# EAGLE design MotorsAndLighthouseShield (EAGLE 9.1.0)

## Sheet 1 of 2
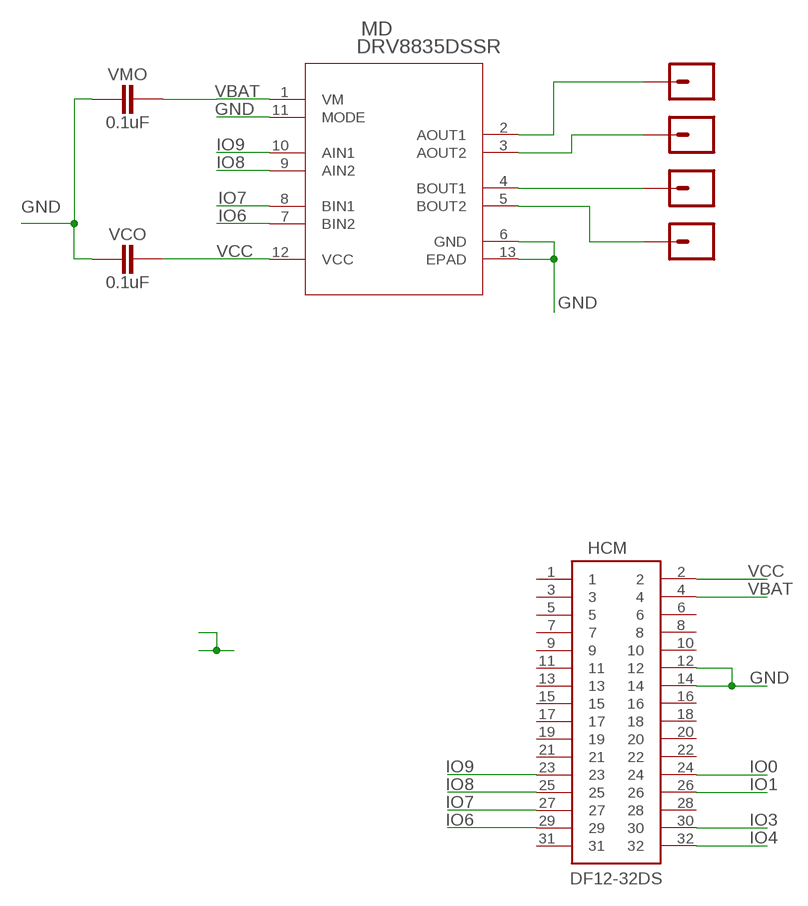
[diagram p0: schematic, sheet 1]

### Parts
AO1  SINGLE-THROUGH-HOLE  [SINGLE-THROUGH-HOLE]
AO2  SINGLE-THROUGH-HOLE  [SINGLE-THROUGH-HOLE]
B02  SINGLE-THROUGH-HOLE  [SINGLE-THROUGH-HOLE]
BO1  SINGLE-THROUGH-HOLE  [SINGLE-THROUGH-HOLE]
HCM  HIROSE-DF12-32DSMALE  [DF12(3.0)-32DS-0.5V(86)-MALE]
MD  DRV8835DSSR  [DSS12_P9X2]
VCO  0.1uF  CAPACITOR  [PASSIVE-0603]
VMO  0.1uF  CAPACITOR  [PASSIVE-0603]

### Nets
GND: HCM.12 HCM.14 MD.6(GND) MD.11(MODE) MD.13(EPAD) VCO.1 VMO.1 ; also sheet 2
IO0: HCM.24 ; also sheet 2
IO1: HCM.26 ; also sheet 2
IO3: HCM.30
IO4: HCM.32
IO6: HCM.29 MD.7(BIN2)
IO7: HCM.27 MD.8(BIN1)
IO8: HCM.25 MD.9(AIN2)
IO9: HCM.23 MD.10(AIN1)
N$1: BO1.1 MD.2(AOUT1)
N$2: B02.1 MD.3(AOUT2)
N$3: AO1.1 MD.4(BOUT1)
N$4: AO2.1 MD.5(BOUT2)
VBAT: HCM.4 MD.1(VM) VMO.2
VCC: HCM.2 MD.12(VCC) VCO.2 ; also sheet 2
Unconnected: HCM.1 HCM.3 HCM.5 HCM.6 HCM.7 HCM.8 HCM.9 HCM.10 HCM.11 HCM.13 HCM.15 HCM.16 HCM.17 HCM.18 HCM.19 HCM.20 HCM.21 HCM.22 HCM.28 HCM.31

## Sheet 2 of 2
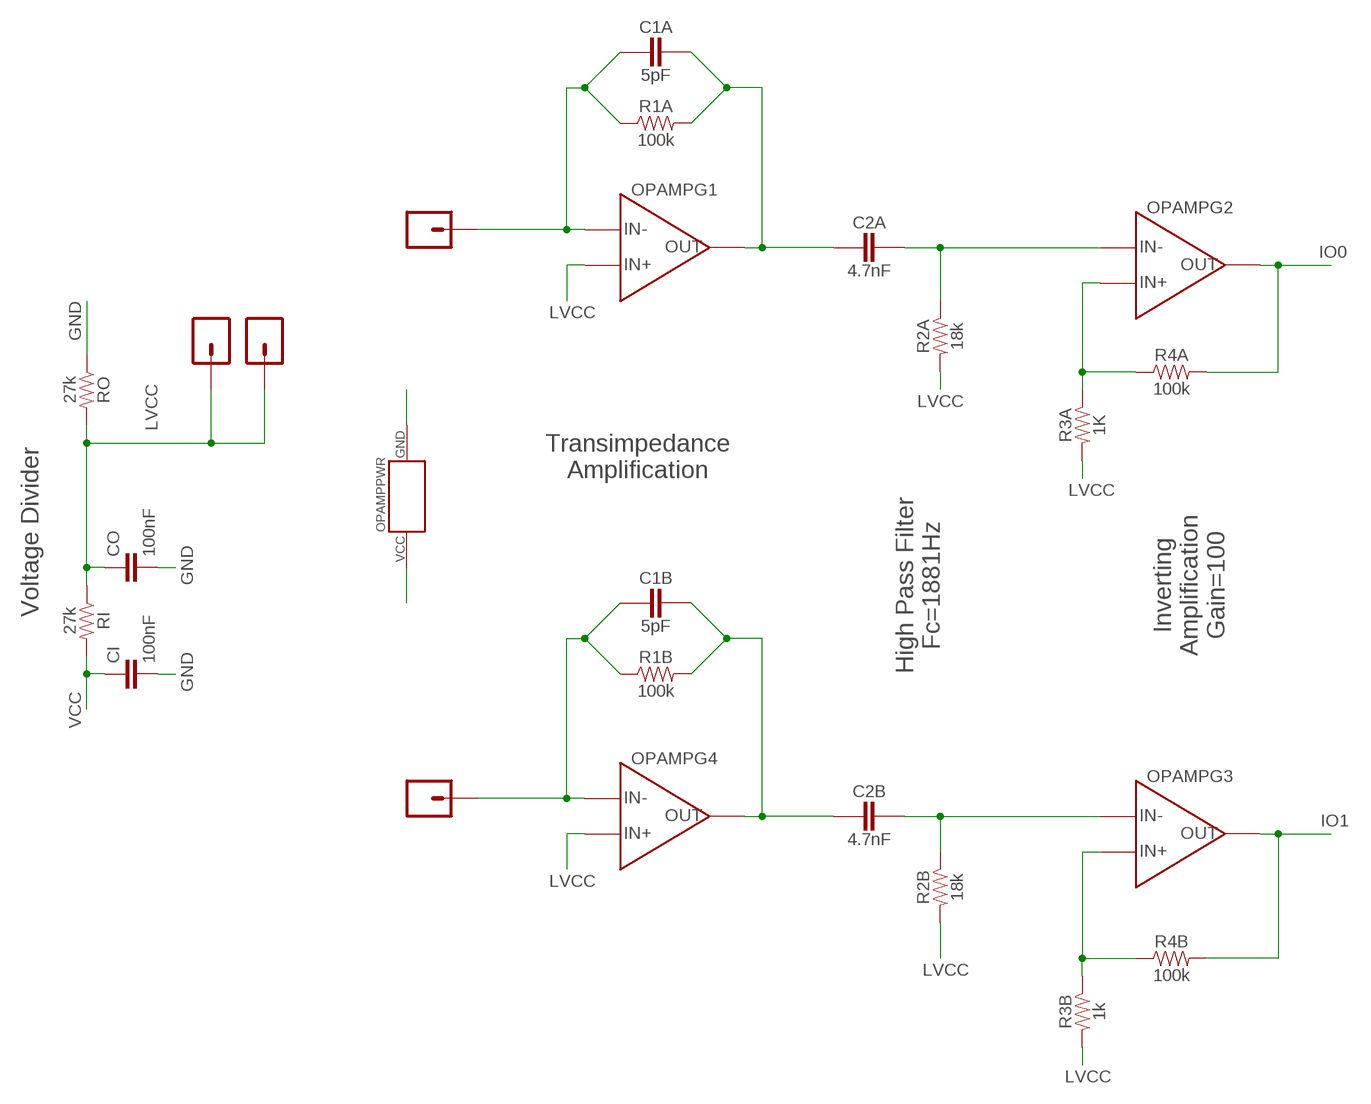
[diagram p1: schematic, sheet 2]

### Parts
C1A  5pF  CAPACITOR  [PASSIVE-0603]
C1B  5pF  CAPACITOR  [PASSIVE-0603]
C2A  4.7nF  CAPACITOR  [PASSIVE-0603]
C2B  4.7nF  CAPACITOR  [PASSIVE-0603]
CI  100nF  4.7PF-0603-50V-5%  [0603]
CO  100nF  4.7PF-0603-50V-5%  [0603]
DIA  SINGLE-THROUGH-HOLE  [SINGLE-THROUGH-HOLE]
DIB  SINGLE-THROUGH-HOLE  [SINGLE-THROUGH-HOLE]
DOA  SINGLE-THROUGH-HOLE  [SINGLE-THROUGH-HOLE]
DOB  SINGLE-THROUGH-HOLE  [SINGLE-THROUGH-HOLE]
OPAMP  TLV2464IPW  [PW14]
R1A  100k  RESISTOR  [PASSIVE-0603]
R1B  100k  RESISTOR  [PASSIVE-0603]
R2A  18k  RESISTOR  [PASSIVE-0603]
R2B  18k  RESISTOR  [PASSIVE-0603]
R3A  1K  RESISTOR  [PASSIVE-0603]
R3B  1k  RESISTOR  [PASSIVE-0603]
R4A  100k  RESISTOR  [PASSIVE-0603]
R4B  100k  RESISTOR  [PASSIVE-0603]
RI  27k  100KOHM-0603-1/10W-1%  [0603]
RO  27k  100KOHM-0603-1/10W-1%  [0603]

### Nets
D1IN1: C1B.1 DIB.1 OPAMP.13(IN-) R1B.1
D1OA2P1: C2B.2 OPAMP.9(IN-) R2B.1
D1OAOUT2: C1B.2 C2B.1 OPAMP.14(OUT) R1B.2
D2IN1: C1A.1 DIA.1 OPAMP.2(IN-) R1A.1
D2OA1OUT1: C1A.2 C2A.1 OPAMP.1(OUT) R1A.2
D2OA2N1: OPAMP.5(IN+) R3A.1 R4A.1
D2OA2P1: C2A.2 OPAMP.6(IN-) R2A.1
GND: CI.2 CO.2 OPAMP.11(PWR:GND) RO.1 ; also sheet 1
IO0: OPAMP.7(OUT) R4A.2 ; also sheet 1
IO1: OPAMP.8(OUT) R4B.2 ; also sheet 1
LVCC: CO.1 DOA.1 DOB.1 OPAMP.3(IN+) OPAMP.12(IN+) R2A.2 R2B.2 R3A.2 R3B.2 RI.1 RO.2
N$11: OPAMP.10(IN+) R3B.1 R4B.1
VCC: CI.1 OPAMP.4(PWR:VCC) RI.2 ; also sheet 1

### Notes on the sheet
- Transimpedance
  Amplification
- Voltage Divider
- High Pass Filter
  Fc=1881Hz
- Inverting
  Amplification
  Gain=100

## Library data of the parts
AO1 AO2 B02 BO1 DIA DIB DOA DOB = ZippyComponentLibrary:SINGLE-THROUGH-HOLE
C1A C1B C2A C2B VCO VMO = ZippyComponentLibrary:CAPACITOR
CI CO = SparkFun-Capacitors:4.7PF: 4.7pF ceramic capacitors A capacitor is a passive two-terminal electrical component used to store electrical energy temporarily in an electric field.; PROD_ID: CAP-07880; VALUE: 4.7pF
HCM = ZippyComponentLibrary:HIROSE-DF12-32DS
MD = ZippyComponentLibrary:DRV8835DSSR; MANUFACTURER_PART_NUMBER: DRV8835DSSR; VENDOR: Texas Instruments
OPAMP = ZippyComponentLibrary:TLV2464
R1A R1B R2A R2B R3A R3B R4A R4B = ZippyComponentLibrary:RESISTOR
RI RO = SparkFun-Resistors:100KOHM: 100kΩ resistor A resistor is a passive two-terminal electrical component that implements electrical resistance as a circuit element. Resistors act to reduce current flow, and, at the same time, act to lower voltage levels within circuits. - Wikipedia; PROD_ID: RES-07828; VALUE: 100k

## Board
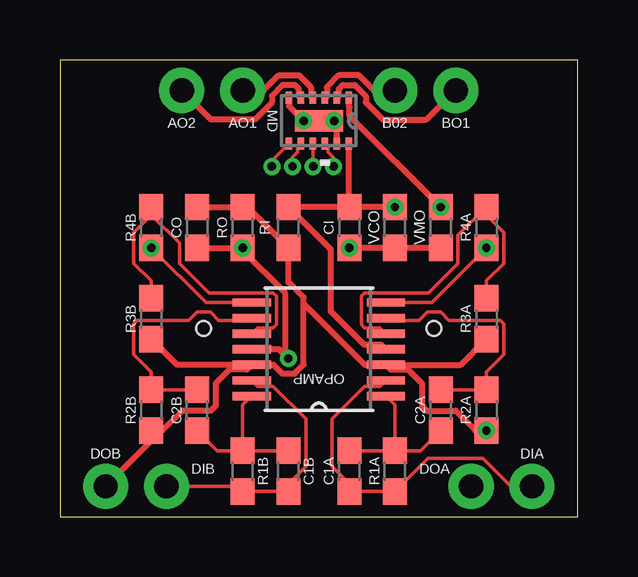
[diagram p2: board, top side]
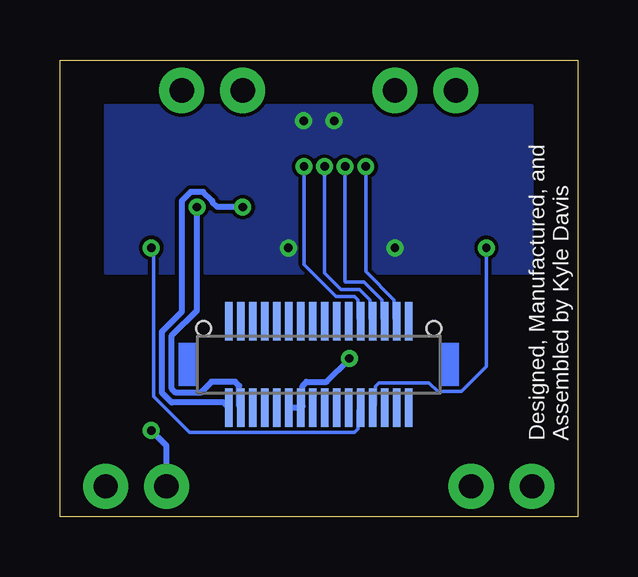
[diagram p3: board, bottom side, seen from below]

Size 21.59 x 19.05 mm. Coordinates in mm from the lower left corner, seen from the top.
Outline: 0,0 21.59,0 21.59,19.05 0,19.05 0,0
Copper layers (1*16): Top 0.0356mm / dielectric 1.5011mm / Bottom 0.0356mm
Design rules "LaenPCBOrder *": minimum track width 6mil, minimum drill 13mil, track to track 6mil, track to pad 6mil, pad to pad 6mil, via to via 6mil, smd to smd 6mil, copper to edge 12mil, drill to drill 6mil, minimum pad ring 7mil, minimum via ring 7mil, stop-mask expansion 3mil, vias tented up to drill 0mil, thermal gap 10mil

### Footprints (pad centres in the part's own frame; a part is rotated, then mirrored left to right if it is on the bottom)
SINGLE-THROUGH-HOLE = drill 1.016 pad 1.88: 1 0,0
PASSIVE-0603 = smd 1.1 x 1: 1 -0.85,0; 2 0.85,0
0603 = smd 1.1 x 1: 1 -0.85,0; 2 0.85,0
DF12(3.0)-32DS-0.5V(86)-MALE = smd 0.3 x 1.6: 1 3.75,-1.8; 2 3.75,1.8; 3 3.25,-1.8; 4 3.25,1.8; 5 2.75,-1.8; 6 2.75,1.8; 7 2.25,-1.8; 8 2.25,1.8; 9 1.75,-1.8; 10 1.75,1.8; 11 1.25,-1.8; 12 1.25,1.8; 13 0.75,-1.8; 14 0.75,1.8; 15 0.25,-1.8; 16 0.25,1.8; 17 -0.25,-1.8; 18 -0.25,1.8; 19 -0.75,-1.8; 20 -0.75,1.8; 21 -1.25,-1.8; 22 -1.25,1.8; 23 -1.75,-1.8; 24 -1.75,1.8; 25 -2.25,-1.8; 26 -2.25,1.8; 27 -2.75,-1.8; 28 -2.75,1.8; 29 -3.25,-1.8; 30 -3.25,1.8; 31 -3.75,-1.8; 32 -3.75,1.8 | hole 0.6: -4.8,-1.5; 4.8,-1.5
DSS12_P9X2 = smd 0.5 x 0.28: 1 -0.959,1.25; 2 -0.959,0.75; 3 -0.959,0.25; 4 -0.959,-0.25; 5 -0.959,-0.75; 6 -0.959,-1.25; 7 0.959,-1.25; 8 0.959,-0.75; 9 0.959,-0.25; 10 0.959,0.25; 11 0.959,0.75; 12 0.959,1.25 | smd 0.9 x 2: 13 0,0
PW14 = smd 1.6 x 0.35: 1 -2.8,1.95; 2 -2.8,1.3; 3 -2.8,0.65; 4 -2.8,0; 5 -2.8,-0.65; 6 -2.8,-1.3; 7 -2.8,-1.95; 8 2.8,-1.95; 9 2.8,-1.3; 10 2.8,-0.65; 11 2.8,0; 12 2.8,0.65; 13 2.8,1.3; 14 2.8,1.95

### Placement (x,y rotation side)
AO1  7.62,17.78 0 top
AO2  5.08,17.78 0 top
B02  13.97,17.78 0 top
BO1  16.51,17.78 0 top
C1A  12.06,1.91 90 top
C1B  9.53,1.91 90 top
C2A  15.88,4.45 90 top
C2B  5.71,4.45 90 top
CI  12.06,12.06 270 top
CO  5.71,12.06 270 top
DIA  19.68,1.27 180 top
DIB  4.45,1.27 180 top
DOA  17.14,1.27 180 top
DOB  1.91,1.27 180 top
HCM  10.79,6.35 180 bottom
MD  10.79,16.51 270 top
OPAMP  10.79,6.99 180 top
R1A  13.97,1.91 90 top
R1B  7.62,1.91 90 top
R2A  17.78,4.45 270 top
R2B  3.81,4.45 270 top
R3A  17.78,8.26 270 top
R3B  3.81,8.26 270 top
R4A  17.78,12.06 270 top
R4B  3.81,12.06 270 top
RI  9.53,12.06 90 top
RO  7.62,12.06 90 top
VCO  13.97,12.06 90 top
VMO  15.88,12.06 90 top

### Tracks (layer width: path | path; a pad name or v marks a point on that pad's centre or on a via)
D1IN1
  Top 0.152: OPAMP.13 8.24,5.44 8.89,5.44 10.25,4.08 10.25,2.11 9.53,1.38 C1B.1 R1B.1 7.41,1.27 DIB.1
D1OA2P1
  Top 0.152: C2B.2 R2B.1 3.81,6.03 3.08,6.76 3.08,8.05 3.21,8.18 5.37,8.18 5.71,8.53 6.28,8.53 6.62,8.18 7.89,8.18 OPAMP.9
D1OAOUT2
  Top 0.152: C1B.2 R1B.2 | R1B.2 6.55,2.75 C2B.1 | OPAMP.14 7.62,4.66 R1B.2
D2IN1
  Top 0.152: OPAMP.2 13.35,5.44 12.7,5.44 11.34,4.08 11.34,2.11 12.06,1.38 C1A.1 R1A.1 15.35,2.44 17.63,2.44 18.8,1.27 DIA.1
D2OA1OUT1
  Top 0.152: R1A.2 C1A.2 | R1A.2 15.04,2.75 C2A.1 | OPAMP.1 13.97,4.66 R1A.2
D2OA2N1
  Top 0.152: R3A.1 17.78,9.84 18.51,10.57 18.51,11.86 17.78,12.59 R4A.1 16.6,11.74 16.6,10.57 15.37,9.34 12.7,9.34 12.57,9.21 12.57,8.02 12.7,7.88 13.35,7.88 OPAMP.5
D2OA2P1
  Top 0.152: C2A.2 R2A.1 17.78,6.03 18.51,6.76 18.51,8.05 18.38,8.18 16.22,8.18 15.88,8.53 15.31,8.53 14.97,8.18 13.7,8.18 OPAMP.6
GND  (via drill 0.35)
  Top 0.152: v11.43,16.51 MD.13 v10.16,16.51
  Top 0.254: CI.2 VCO.1 VMO.1 | CO.2 RO.1 7.62,11.11 9.38,9.35 9.38,6.75 v9.53,6.6 9.14,6.99 OPAMP.11 | MD.6 9.54,17.12 v10.16,16.51 | MD.11 11.54,16.39 v11.43,16.51
  Bottom 0.254: HCM.12 HCM.14 11.47,4.62 11.47,5.47 11.31,5.63 10.47,5.63 9.53,6.57 v9.53,6.6
  other vias: 7.62,11.21 12.06,11.21
  pour Bottom: 1.91,17.14 19.68,17.14 19.68,10.16 1.91,10.16
IO0  (via drill 0.35)
  Top 0.152: R4A.2 15.5,8.94 OPAMP.7
  Bottom 0.152: HCM.24 9.17,4.43 9.17,3.65 9.3,3.52 16.19,3.52 17.69,5.02 17.69,11.12 R4A.2
  other vias: 17.78,11.21
IO1  (via drill 0.35)
  Top 0.152: OPAMP.8 6.09,8.94 R4B.2
  Bottom 0.152: HCM.26 8.42,4.67 8.42,5.45 8.29,5.58 6.2,5.58 5.84,5.22 4.85,5.22 3.81,6.26 R4B.2
  other vias: 3.81,11.21
IO6  (via drill 0.35)
  Top 0.152: MD.7 8.84,14.85 v8.84,14.61
  Bottom 0.152: HCM.29 7.67,8.27 7.67,9.04 8.84,10.22 v8.84,14.61
IO7  (via drill 0.35)
  Top 0.152: MD.8 9.91,15.42 9.91,15.21 9.7,14.99 v9.7,14.61
  Bottom 0.152: v9.7,14.61 9.7,9.8 9.68,9.79 8.91,9.79 8.17,9.04 8.17,8.27 HCM.27
IO8  (via drill 0.35)
  Top 0.152: v10.55,14.61 10.55,15.54 MD.9
  Bottom 0.152: v10.55,14.61 10.55,10.16 9.88,9.48 9.11,9.48 8.67,9.04 8.67,8.27 HCM.25
IO9  (via drill 0.35)
  Top 0.152: MD.10 11.18,15.42 11.18,15.21 11.41,14.97 v11.41,14.61
  Bottom 0.152: v11.41,14.61 11.41,10.52 10.07,9.18 9.3,9.18 9.17,9.04 9.17,8.27 HCM.23
LVCC  (via drill 0.35)
  Top 0.254: OPAMP.12 4.88,6.33 R3B.2 | OPAMP.3 16.71,6.33 R3A.2 | OPAMP.12 7.8,6.14 7.08,6.14 6.49,5.55 6.49,4.63 6.29,4.42 5.1,4.42 4.27,3.6 R2B.2 3.81,3.17 DOB.1 | OPAMP.3 13.79,6.14 14.51,6.14 15.1,5.55 15.1,4.63 15.3,4.42 16.49,4.42 17.32,3.6 R2A.2 | CO.1 RO.2 7.83,12.91 RI.1 9.53,9.78 10.16,9.15 10.16,8.89 | OPAMP.12 8.9,6.33 9.26,5.97 9.79,5.97 10.16,6.34 10.16,8.89 | 10.16,8.89 12.71,6.33 OPAMP.3
  Bottom 0.254: DOA.1 17.14,2.96 R2A.2
  other vias: 17.78,3.6
N$1
  Top 0.254: MD.2 11.63,17.55 11.63,17.84 11.79,18 12.3,18 12.75,17.55 12.75,17.27 13.46,16.56 15.29,16.56 BO1.1
N$2
  Top 0.254: B02.1 13.09,17.78 12.47,18.41 11.62,18.41 11.13,17.91 11.13,17.55 MD.3
N$3
  Top 0.254: MD.4 10.46,17.55 10.46,17.91 9.97,18.41 9.12,18.41 8.5,17.78 AO1.1
N$4
  Top 0.254: MD.5 9.96,17.55 9.96,17.83 9.8,18 9.29,18 8.84,17.55 8.84,17.27 8.12,16.56 6.3,16.56 AO2.1
N$11
  Top 0.152: R3B.1 3.81,9.84 3.08,10.57 3.08,11.86 3.81,12.59 | 3.81,12.59 R4B.1 3.81,12.59 | OPAMP.10 8.24,7.88 8.89,7.88 9.02,8.02 9.02,9.21 8.89,9.34 6.22,9.34 4.99,10.57 4.99,11.41 3.81,12.59
VBAT  (via drill 0.35)
  Top 0.254: VMO.2 12.07,16.72 12.07,17.08 12.04,17.11 MD.1
  Bottom 0.254: HCM.4 14.12,4.62 14.12,5.47 14.28,5.63 15.27,5.63 15.73,5.17 16.76,5.17 16.92,5.33 16.92,7.56 15.88,8.61 VMO.2
  other vias: 15.88,12.91
VCC  (via drill 0.35)
  Top 0.254: VCO.2 CI.1 | CI.1 RI.2 11.29,11.15 11.29,8.57 12.68,7.18 13.4,7.18 OPAMP.4 | CI.1 12.04,12.94 MD.12
  Bottom 0.254: HCM.2 14.76,4.76 16.93,4.76 17.33,5.17 17.33,7.72 16.51,8.54 16.51,13.17 16.14,13.55 15.61,13.55 15.24,13.18 15.24,13.13 15.03,12.91 VCO.2
  other vias: 13.97,12.91

### Text on the board
bPlace: Designed, Manufactured, and / Assembled by Kyle Davis